# Altium schematic sheet Bench.SchDoc
size 800 x 800 mm; SheetNumber: 1; SheetTotal: 1
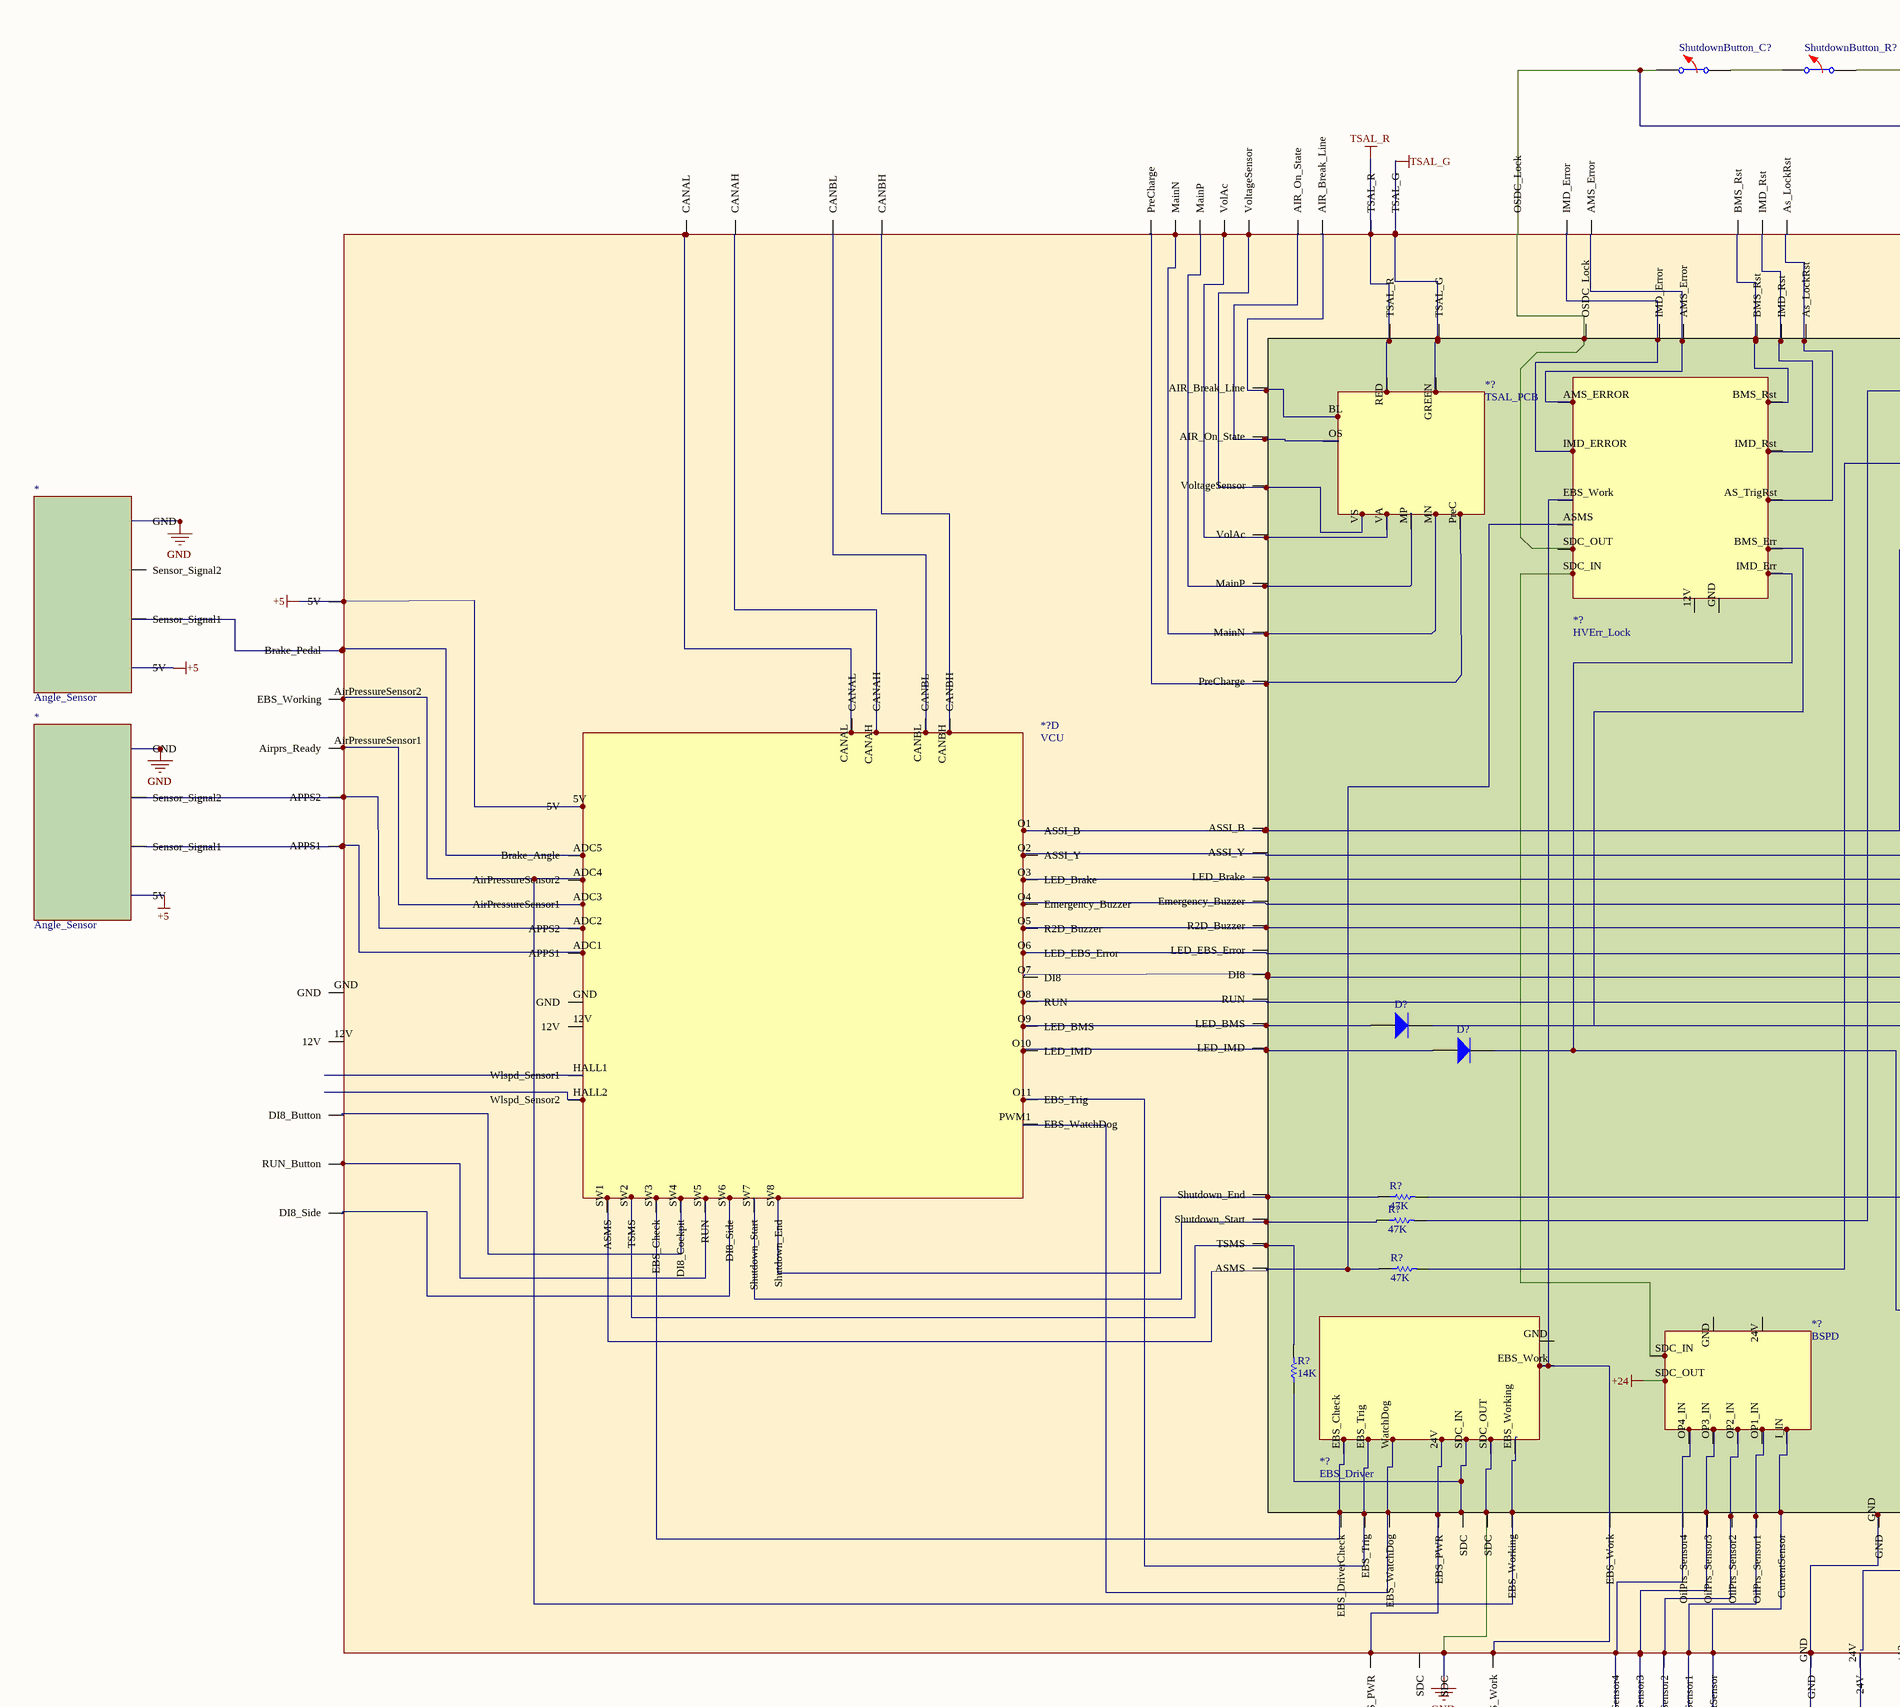
[diagram p0: Bench.SchDoc, top left]
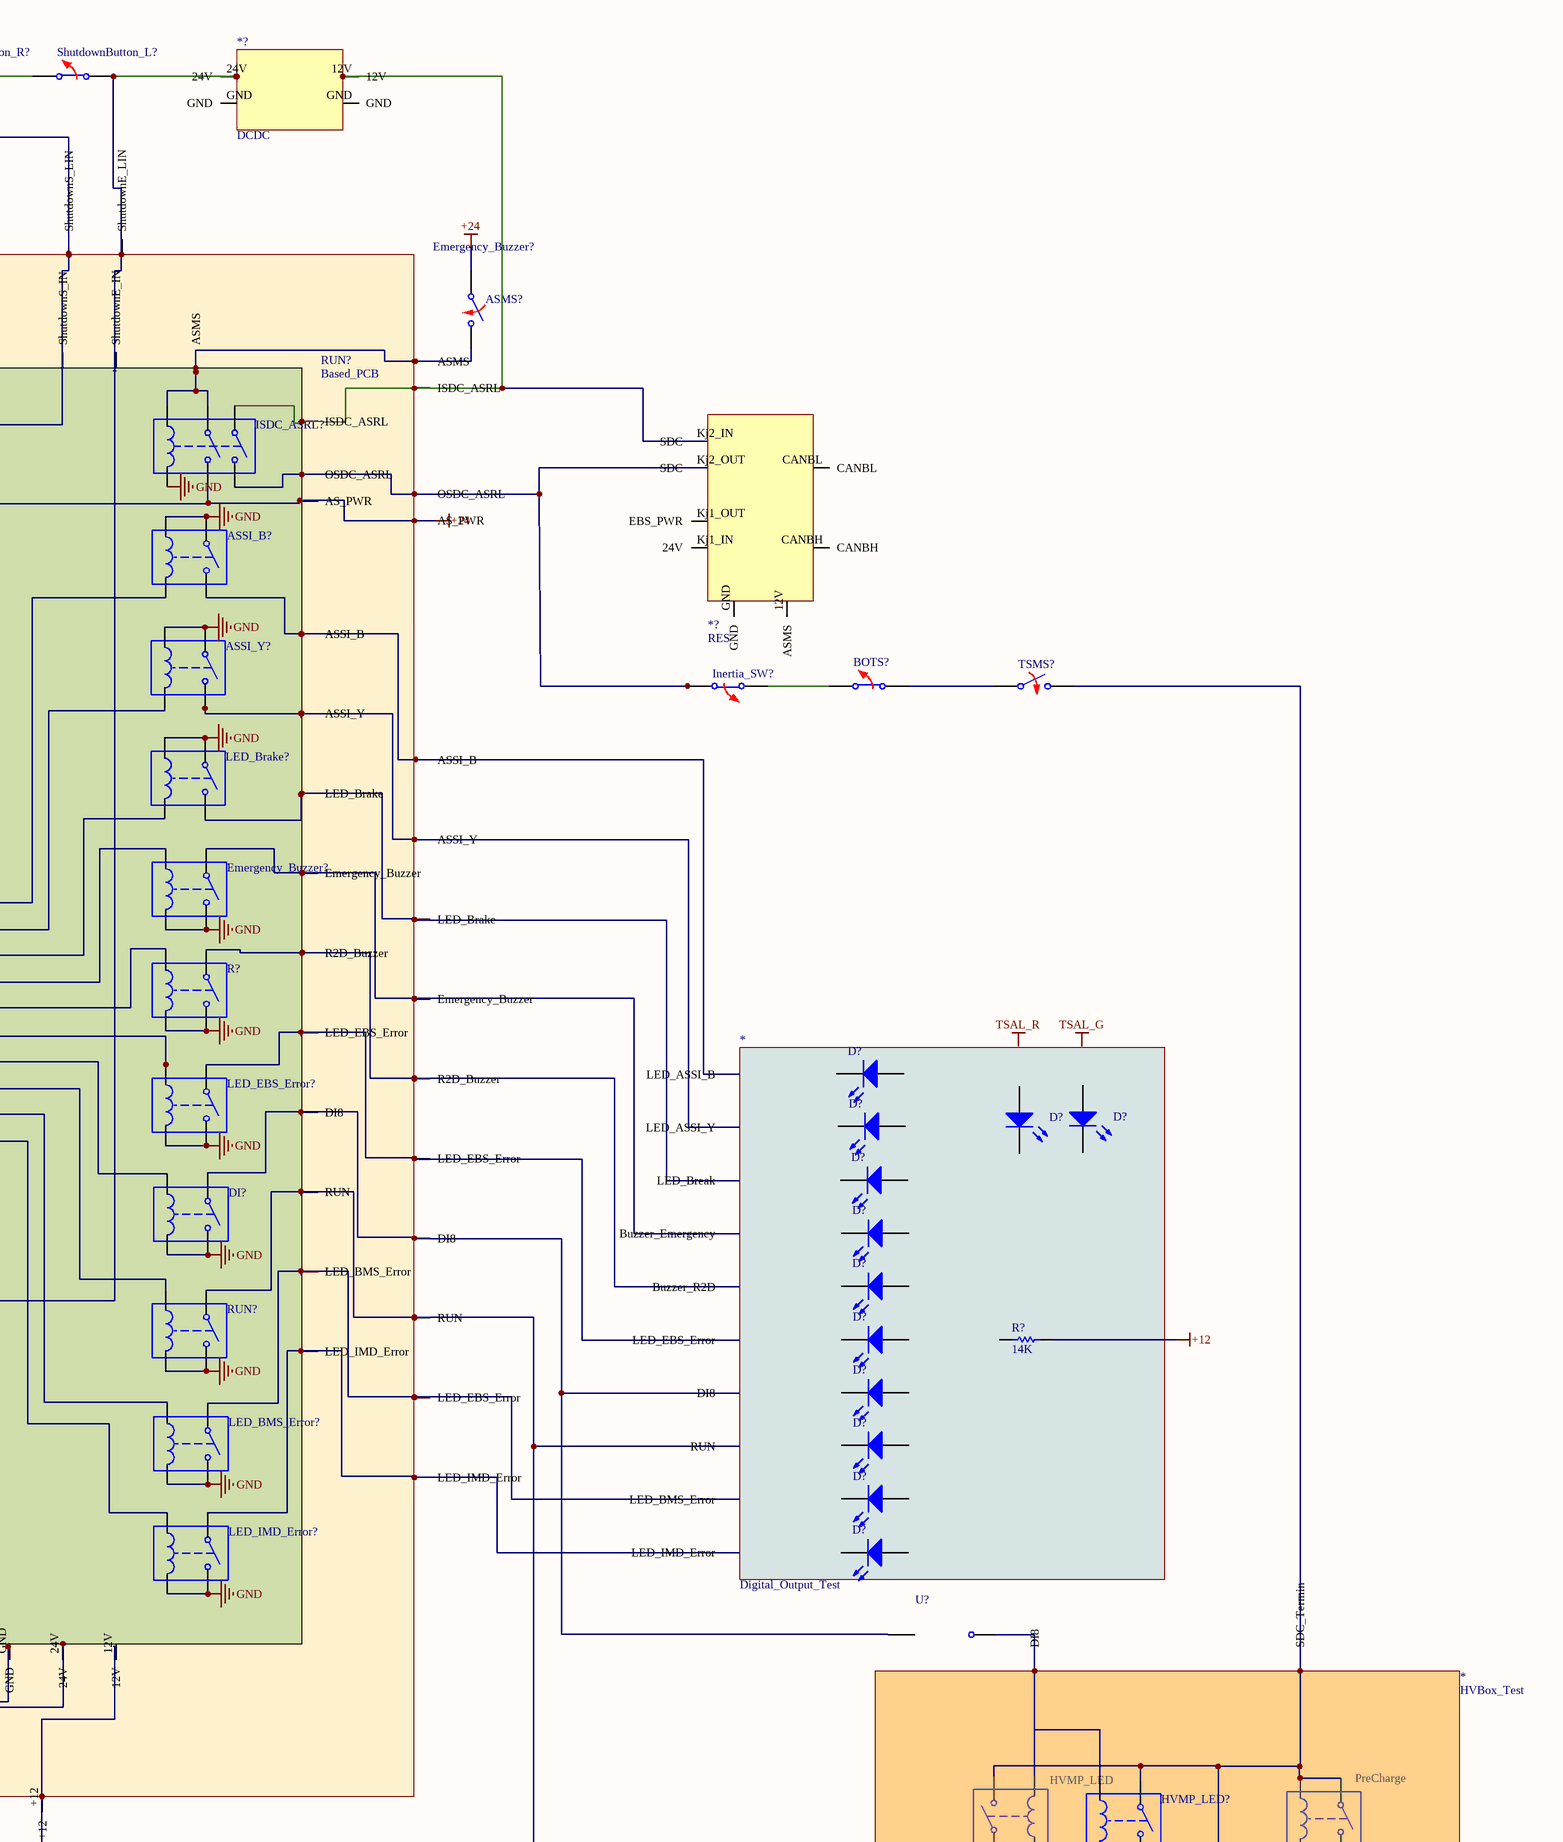
[diagram p1: Bench.SchDoc, top right]
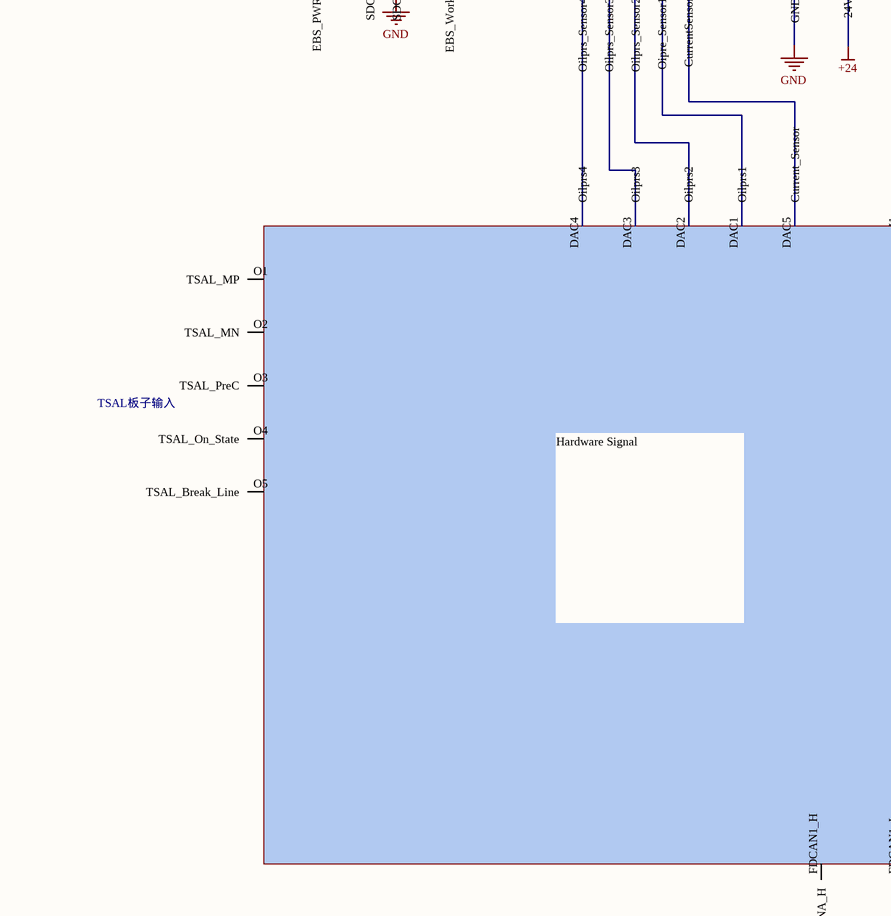
[diagram p2: Bench.SchDoc, bottom left]
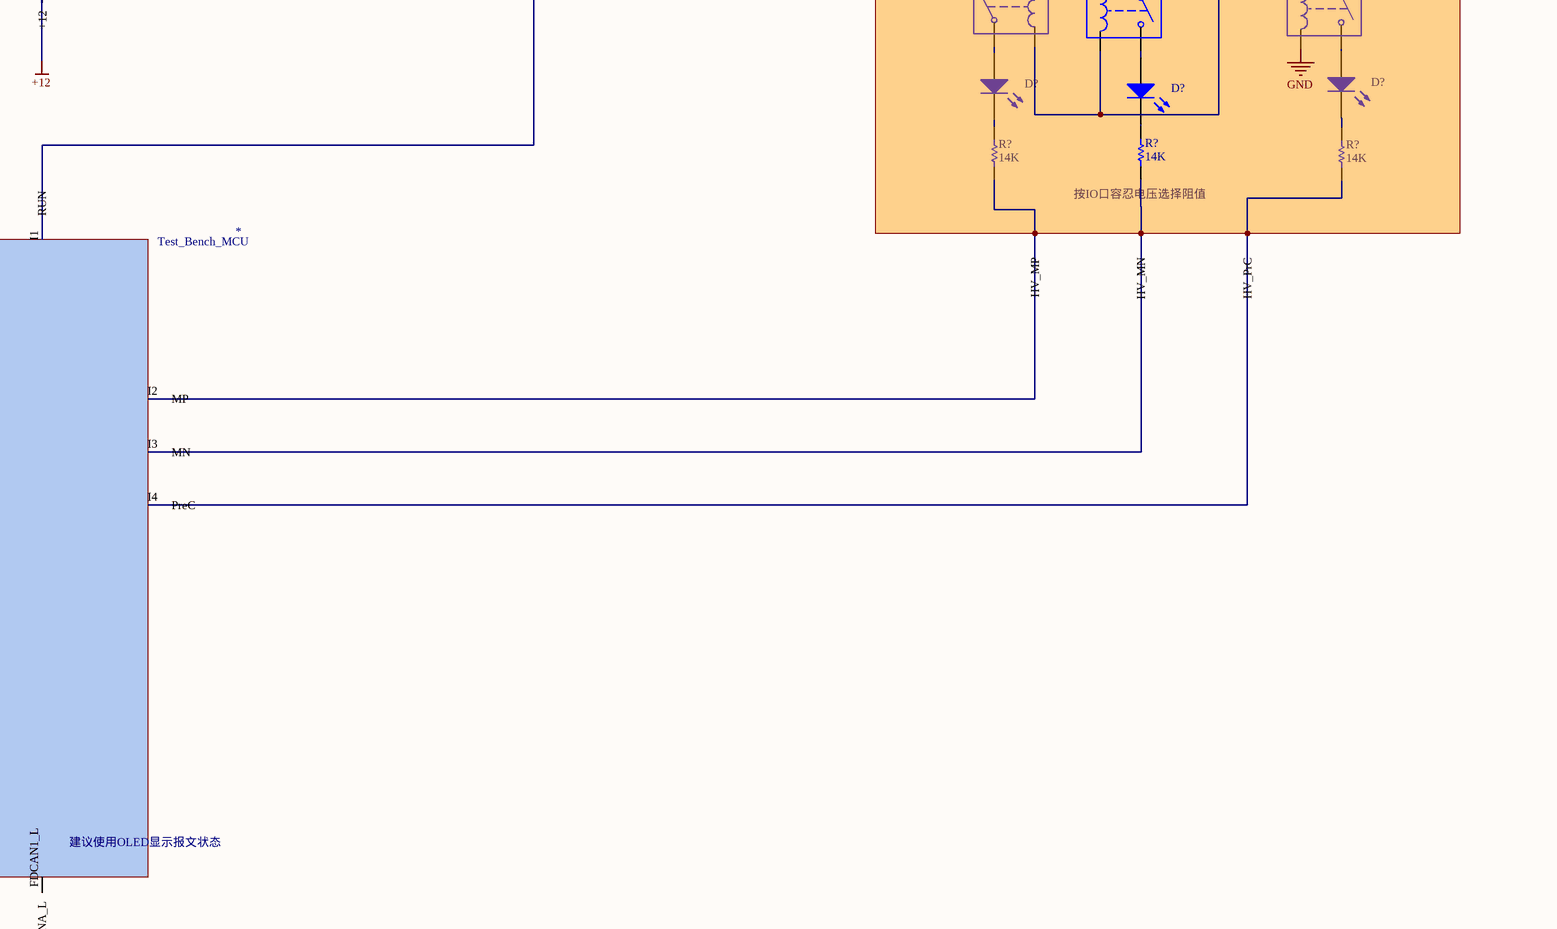
[diagram p3: Bench.SchDoc, bottom right]

## Parts
(Parts that share a designator on the sheet are numbered #1, #2 ... from top to bottom, then left to right.)
*#1  Angle_Sensor
*#2  Angle_Sensor
*#3  Digital_Output_Test
*#4  HVBox_Test
*#5  Test_Bench_MCU
*?#1  DCDC
*?#2  RES
*?#3  TSAL_PCB
*?#4  HVErr_Lock
*?#5  VCU  (part D of 4)
*?#6  BSPD
*?#7  EBS_Driver
ASMS?  Switch Normally Opened  (value not drawn)
ASSI_B?  Single-Pole, Single-Throw Normally Opened Relay  (value not drawn)
ASSI_Y?  Single-Pole, Single-Throw Normally Opened Relay  (value not drawn)
BOTS?  Switch Normally Closed  (value not drawn)
D?#1  Light-Emitting Diode  (value not drawn)
D?#2  Light-Emitting Diode  (value not drawn)
D?#3  Light-Emitting Diode  (value not drawn)
D?#4  Diode  (value not drawn)
D?#5  Light-Emitting Diode  (value not drawn)
D?#6  Diode  (value not drawn)
D?#7  Light-Emitting Diode  (value not drawn)
D?#8  Light-Emitting Diode  (value not drawn)
D?#9  Light-Emitting Diode  (value not drawn)
D?#10  Light-Emitting Diode  (value not drawn)
D?#11  Light-Emitting Diode  (value not drawn)
D?#12  Light-Emitting Diode  (value not drawn)
D?#13  Light-Emitting Diode  (value not drawn)
D?#14  Light-Emitting Diode  (value not drawn)
D?#15  Light-Emitting Diode  (value not drawn)
D?#16  Light-Emitting Diode  (value not drawn)
D?#17  Light-Emitting Diode  (value not drawn)
DI?  Single-Pole, Single-Throw Normally Opened Relay  (value not drawn)
Emergency_Buzzer?#1  Single-Pole, Single-Throw Normally Opened Relay  (value not drawn)
Emergency_Buzzer?#2  (no value)
HVMP_LED  Single-Pole, Single-Throw Normally Opened Relay  (value not drawn)
HVMP_LED?  Single-Pole, Single-Throw Normally Opened Relay  (value not drawn)
Inertia_SW?  Switch Normally Closed  (value not drawn)
ISDC_ASRL?  Double-Pole, Single-Throw Relay  (value not drawn)
LED_BMS_Error?  Single-Pole, Single-Throw Normally Opened Relay  (value not drawn)
LED_Brake?  Single-Pole, Single-Throw Normally Opened Relay  (value not drawn)
LED_EBS_Error?  Single-Pole, Single-Throw Normally Opened Relay  (value not drawn)
LED_IMD_Error?  Single-Pole, Single-Throw Normally Opened Relay  (value not drawn)
PreCharge  Single-Pole, Single-Throw Normally Opened Relay  (value not drawn)
R?#1  Single-Pole, Single-Throw Normally Opened Relay  (value not drawn)
R?#2  value 47K  (hidden comment: Resistor)
R?#3  value 47K  (hidden comment: Resistor)
R?#4  value 14K  (hidden comment: Resistor)
R?#5  value 47K  (hidden comment: Resistor)
R?#6  value 14K  (hidden comment: Resistor)
R?#7  value 14K  (hidden comment: Resistor)
R?#8  value 14K  (hidden comment: Resistor)
R?#9  value 14K  (hidden comment: Resistor)
RUN?#1  Single-Pole, Single-Throw Normally Opened Relay  (value not drawn)
RUN?#2  Based_PCB
ShutdownButton_C?  Switch Normally Closed  (value not drawn)
ShutdownButton_L?  Switch Normally Closed  (value not drawn)
ShutdownButton_R?  Switch Normally Closed  (value not drawn)
TSMS?  Switch Normally Opened  (value not drawn)
U?  Digital NOT Gate  (value not drawn)

## Nets
+5: *#1.?1(5V) *#2.?1(5V) *?#5.5V Emergency_Buzzer?#2.?43(5V)
+12: Emergency_Buzzer?#2.+12 R?#4.1
+24: *?#6.SDC_OUT ASMS?.1 Emergency_Buzzer?#2.24V Emergency_Buzzer?#2.?27(AS_PWR) ISDC_ASRL?.4 R?#5.2
GND: *#1.?4(GND) *#2.?4(GND) *?#7.SDC_OUT ASSI_B?.1 ASSI_B?.3 ASSI_Y?.1 ASSI_Y?.3 DI?.2 DI?.4 Emergency_Buzzer?#1.2 Emergency_Buzzer?#1.4 Emergency_Buzzer?#2.?37(SDC) Emergency_Buzzer?#2.GND ISDC_ASRL?.6 LED_BMS_Error?.2 LED_BMS_Error?.4 LED_Brake?.1 LED_Brake?.3 LED_EBS_Error?.2 LED_EBS_Error?.4 LED_IMD_Error?.2 LED_IMD_Error?.4 PreCharge.4 R?#1.2 R?#1.4 RUN?#1.2 RUN?#1.4 RUN?#2.?2(SDC) RUN?#2.GND
TSAL_G: *?#3.GREEN Emergency_Buzzer?#2.?18(TSAL_G) RUN?#2.?27(TSAL_G)
TSAL_R: *?#3.RED Emergency_Buzzer?#2.?17(TSAL_R)
Net*#1_?2: *#1.?2(Sensor_Signal1) *?#5.ADC5(Brake_Angle) Emergency_Buzzer?#2.?1(Brake_Pedal)
Net*#2_?2: *#2.?2(Sensor_Signal1) *?#5.ADC1(APPS1) Emergency_Buzzer?#2.?3(APPS1)
Net*#2_?3: *#2.?3(Sensor_Signal2) *?#5.ADC2(APPS2) Emergency_Buzzer?#2.?2(APPS2)
Net*#3_?1: *#3.?1(LED_ASSI_B) ASSI_B?.2 Emergency_Buzzer?#2.?28(ASSI_B) RUN?#2.?37(ASSI_B)
Net*#3_?2: *#3.?2(LED_ASSI_Y) ASSI_Y?.2 Emergency_Buzzer?#2.?29(ASSI_Y) RUN?#2.?38(ASSI_Y)
Net*#3_?3: *#3.?3(LED_Break) Emergency_Buzzer?#2.?30(LED_Brake) LED_Brake?.2 RUN?#2.?39(LED_Brake)
Net*#3_?4: *#3.?4(Buzzer_Emergency) Emergency_Buzzer?#1.1 Emergency_Buzzer?#2.?31(Emergency_Buzzer) RUN?#2.?40(Emergency_Buzzer)
Net*#3_?5: *#3.?5(Buzzer_R2D) Emergency_Buzzer?#2.?32(R2D_Buzzer) R?#1.1 RUN?#2.?41(R2D_Buzzer)
Net*#3_?6: *#3.?6(LED_EBS_Error) Emergency_Buzzer?#2.?33(LED_EBS_Error) LED_EBS_Error?.1 RUN?#2.?42(LED_EBS_Error)
Net*#3_?7: *#3.?7(DI8) DI?.1 Emergency_Buzzer?#2.?34(DI8) RUN?#2.?43(DI8) U?.1
Net*#3_?8: *#3.?8(RUN) *#5.I1(RUN) Emergency_Buzzer?#2.?35(RUN) RUN?#1.1 RUN?#2.?44(RUN)
Net*#3_?9: *#3.?9(LED_BMS_Error) Emergency_Buzzer?#2.?50(LED_EBS_Error) LED_BMS_Error?.1
Net*#3_?10: *#3.?10(LED_IMD_Error) Emergency_Buzzer?#2.?51(LED_IMD_Error) LED_IMD_Error?.1
Net*#4_?1: *#4.?1(SDC_Termin) HVMP_LED.2 HVMP_LED.3 HVMP_LED?.1 HVMP_LED?.4 PreCharge.1 PreCharge.3 TSMS?.2
Net*#4_?2: *#4.?2(DI8) HVMP_LED.4 HVMP_LED?.3 U?.2
Net*#4_?3: *#4.?3(HV_MP) *#5.I2(MP) R?#7.2
Net*#4_?4: *#4.?4(HV_MN) *#5.I3(MN) R?#8.2
Net*#4_?5: *#4.?5(HV_PrC) *#5.I4(PreC) R?#9.2
Net*#5_DAC1: *#5.DAC1(Oilprs1) *?#6.OP1_IN Emergency_Buzzer?#2.?41(Oipre_Sensor1)
Net*#5_DAC2: *#5.DAC2(Oilprs2) *?#6.OP2_IN Emergency_Buzzer?#2.?46(Oilprs_Sensor2)
Net*#5_DAC3: *#5.DAC3(Oilprs3) *?#6.OP3_IN Emergency_Buzzer?#2.?40(Oilprs_Sensor3) RUN?#2.?48(OilPrs_Sensor3)
Net*#5_DAC4: *#5.DAC4(Oilprs4) *?#6.OP4_IN Emergency_Buzzer?#2.?47(Oilprs_Sensor4)
Net*#5_DAC5: *#5.DAC5(Current_Sensor) *?#6.I_IN Emergency_Buzzer?#2.?42(CurrentSensor) RUN?#2.?8(CurrentSensor)
Net*?#1_12V: *?#1.12V *?#2.Kj2_IN(SDC) Emergency_Buzzer?#2.?25(ISDC_ASRL) ISDC_ASRL?.1 RUN?#2.?35(ISDC_ASRL)
Net*?#1_24V: *?#1.24V Emergency_Buzzer?#2.?49(ShutdownE_LIN) R?#2.2 ShutdownButton_L?.2
Net*?#2_Kj2_OUT: *?#2.Kj2_OUT(SDC) Emergency_Buzzer?#2.?26(OSDC_ASRL) Inertia_SW?.2 ISDC_ASRL?.2 RUN?#2.?36(OSDC_ASRL)
Net*?#3_BL: *?#3.BL Emergency_Buzzer?#2.?16(AIR_Break_Line)
Net*?#3_MN: *?#3.MN Emergency_Buzzer?#2.?11(MainN)
Net*?#3_MP: *?#3.MP Emergency_Buzzer?#2.?12(MainP)
Net*?#3_OS: *?#3.OS Emergency_Buzzer?#2.?15(AIR_On_State)
Net*?#3_PreC: *?#3.PreC Emergency_Buzzer?#2.?10(PreCharge)
Net*?#3_VA: *?#3.VA Emergency_Buzzer?#2.?13(VolAc)
Net*?#3_VS: *?#3.VS Emergency_Buzzer?#2.?14(VoltageSensor)
Net*?#4_AMS_ERROR: *?#4.AMS_ERROR Emergency_Buzzer?#2.?20(AMS_Error)
Net*?#4_AS_TrigRst: *?#4.AS_TrigRst Emergency_Buzzer?#2.?22(As_LockRst)
Net*?#4_ASMS: *?#4.ASMS *?#5.SW1(ASMS) R?#5.1
Net*?#4_BMS_Err: *?#4.BMS_Err D?#4.2(K) LED_BMS_Error?.3
Net*?#4_BMS_Rst: *?#4.BMS_Rst Emergency_Buzzer?#2.?23(BMS_Rst) RUN?#2.?32(BMS_Rst)
Net*?#4_EBS_Work: *?#4.EBS_Work *?#7.EBS_Work Emergency_Buzzer?#2.?39(EBS_Work)
Net*?#4_IMD_Err: *?#4.IMD_Err D?#6.2(K) LED_IMD_Error?.3
Net*?#4_IMD_ERROR: *?#4.IMD_ERROR Emergency_Buzzer?#2.?21(IMD_Error)
Net*?#4_IMD_Rst: *?#4.IMD_Rst Emergency_Buzzer?#2.?44(IMD_Rst)
Net*?#4_SDC_IN: *?#4.SDC_IN *?#6.SDC_IN
Net*?#4_SDC_OUT: *?#4.SDC_OUT Emergency_Buzzer?#2.?19(OSDC_Lock) Emergency_Buzzer?#2.?48(ShutdownS_LIN) R?#3.2 RUN?#2.?30(OSDC_Lock) ShutdownButton_C?.1
Net*?#5_ADC4: *?#5.ADC4(AirPressureSensor2) RUN?#2.?6(EBS_Working)
Net*?#5_O1: *?#5.O1(ASSI_B) ASSI_B?.4 RUN?#2.?18(ASSI_B)
Net*?#5_O2: *?#5.O2(ASSI_Y) ASSI_Y?.4
Net*?#5_O3: *?#5.O3(LED_Brake) LED_Brake?.4
Net*?#5_O4: *?#5.O4(Emergency_Buzzer) Emergency_Buzzer?#1.3
Net*?#5_O5: *?#5.O5(R2D_Buzzer) R?#1.3
Net*?#5_O6: *?#5.O6(LED_EBS_Error) LED_EBS_Error?.3
Net*?#5_O8: *?#5.O8(RUN) RUN?#1.3
Net*?#5_O9: *?#5.O9(LED_BMS) D?#4.1(A)
Net*?#5_O10: *?#5.O10(LED_IMD) D?#6.1(A) RUN?#2.?57(LED_IMD)
Net*?#5_O11: *?#5.O11(EBS_Trig) *?#7.EBS_Trig
Net*?#5_PWM1: *?#5.PWM1(EBS_WatchDog) *?#7.WatchDog RUN?#2.?5(EBS_WatchDog)
Net*?#5_SW2: *?#5.SW2(TSMS) R?#6.2
Net*?#5_SW3: *?#5.SW3(EBS_Check) *?#7.EBS_Check RUN?#2.?3(EBS_DriverCheck)
Net*?#5_SW8: *?#5.SW8(Shutdown_End) R?#2.1 RUN?#2.?53(Shutdown_End)
Net*?#7_24V: *?#7.24V Emergency_Buzzer?#2.?36(EBS_PWR)
Net*?#7_SDC_IN: *?#7.SDC_IN R?#6.1 RUN?#2.?1(SDC)
NetASMS?_2: ASMS?.2 Emergency_Buzzer?#2.?24(ASMS) ISDC_ASRL?.3 ISDC_ASRL?.5 RUN?#2.?33(ASMS)
NetBOTS?_1: BOTS?.1 Inertia_SW?.1
NetBOTS?_2: BOTS?.2 TSMS?.1
NetD?#15_1: D?#15.1(A) HVMP_LED.1
NetD?#15_2: D?#15.2(K) R?#7.1
NetD?#16_1: D?#16.1(A) HVMP_LED?.2
NetD?#16_2: D?#16.2(K) R?#8.1
NetD?#17_1: D?#17.1(A) PreCharge.2
NetD?#17_2: D?#17.2(K) R?#9.1
NetDI?_3: DI?.3 RUN?#2.?24(DI8)
NetShutdownButton_C?_2: ShutdownButton_C?.2 ShutdownButton_R?.1
NetShutdownButton_L?_1: ShutdownButton_L?.1 ShutdownButton_R?.2

Not connected (* = marked no-connect by the designer): *#1 ?3(Sensor_Signal2); *#5 FDCAN1_H(CANA_H) FDCAN1_L(CANA_L) O1(TSAL_MP) O2(TSAL_MN) O3(TSAL_PreC) O4(TSAL_On_State) O5(TSAL_Break_Line); *?#1 GND; *?#2 12V(ASMS) CANBH CANBL GND Kj1_IN(24V) Kj1_OUT(EBS_PWR); *?#4 12V GND; *?#5 12V ADC3(AirPressureSensor1) CANAH CANAL CANBH CANBL GND HALL1(Wlspd_Sensor1) HALL2(Wlspd_Sensor2) O7(DI8) SW4(DI8_Cockpit) SW5(RUN) SW6(DI8_Side) SW7(Shutdown_Start); *?#6 24V GND; *?#7 EBS_Working GND; D?#1 1(A) 2(K); D?#2 1(A) 2(K); D?#3 1(A) 2(K); D?#5 1(A) 2(K); D?#7 1(A) 2(K); D?#8 1(A) 2(K); D?#9 1(A) 2(K); D?#10 1(A) 2(K); D?#11 1(A) 2(K); D?#12 1(A) 2(K); D?#13 1(A) 2(K); D?#14 1(A) 2(K); Emergency_Buzzer?#2 12V ?4(DI8_Button) ?5(RUN_Button) ?6(CANAL) ?7(CANAH) ?8(CANBL) ?9(CANBH) ?38(SDC) ?45(DI8_Side) AirPressureSensor1(Airprs_Ready) AirPressureSensor2(EBS_Working); R?#3 1; R?#4 2; RUN?#2 12V 24V ?4(EBS_Trig) ?7(EBS_Work) ?9(OilPrs_Sensor1) ?10(OilPrs_Sensor2) ?11(AIR_Break_Line) ?12(AIR_On_State) ?13(VoltageSensor) ?14(VolAc) ?15(MainP) ?16(MainN) ?17(PreCharge) ?19(ASSI_Y) ?20(LED_Brake) ?21(Emergency_Buzzer) ?22(R2D_Buzzer) ?23(LED_EBS_Error) ?25(RUN) ?26(TSAL_R) ?28(IMD_Error) ?29(AMS_Error) ?31(IMD_Rst) ?34(AS_PWR) ?45(EBS_PWR) ?46(ASMS) ?47(TSMS) ?49(OilPrs_Sensor4) ?50(ShutdownS_IN) ?51(ShutdownE_IN) ?52(Shutdown_Start) ?54(LED_BMS_Error) ?55(LED_IMD_Error) ?56(LED_BMS) ?58(As_LockRst)

## Notes on the sheet
- (near *#4) 按IO口容忍电压选择阻值
- TSAL板子输入
- (near *#5) Hardware Signal
- Labels drawn without touching a wire or pin: TSAL_G, TSAL_R
- (in symbol Test_Bench_MCU) 建议使用OLED显示报文状态

## Library data of the parts
ASMS? TSMS? = SW NO: closed: 0; Rclosed: 1m; Ropen: 1Meg; SimulationGenericComponent: True
ASSI_B? ASSI_Y? DI? Emergency_Buzzer?#1 HVMP_LED HVMP_LED? LED_BMS_Error? LED_Brake? LED_EBS_Error? LED_IMD_Error? PreCharge R?#1 RUN?#1 = SPST Relay NO: L_C: 1u; R_C: 100; RON: 1; ROFF: 1e12; ION: 1m; IOFF: 0; SimulationGenericComponent: True
BOTS? Inertia_SW? ShutdownButton_C? ShutdownButton_L? ShutdownButton_R? = SW NC: closed: 1; Rclosed: 1m; Ropen: 1Meg; SimulationGenericComponent: True
D?#1-D?#3 D?#5 D?#7-D?#17 = LED: AF: 1; BV: 0; BV_MAX: 1e99; EG: 1.11; FC: 0.5; IBV: 0.001; IS: 1e-14; MJSW: 0.33; NTUN: 30; TNOM: 27; XTI: 3; SimulationGenericComponent: True; CJO: 0; CJP: 0; CTA: 0; CTP: 0; FCS: 0.5; FV_MAX: 1e99; IKF: 0; IKR: 0; ISR: 1e-14; JSW: 0; JTUN: 0; JTUNSW: 0; KEG: 1; KF: 0; LEVEL: 1; N: 1; NBV: 1; NR: 1; NS: 1; PHP: 1; RS: 0; TCV: 0; TLEV: 0; TLEVC: 0; TM1: 0; TM2: 0; TPB: 0; TPHP: 0; TRS: 0; TRS2: 0; TT: 0; TTT1: 0; TTT2: 0; VJ: 1; XTITUN: 3
D?#4 D?#6 = Diode: AF: 1; BV: 0; BV_MAX: 1e99; EG: 1.11; FC: 0.5; IBV: 0.001; ISR: 1e-14; MJSW: 0.33; NTUN: 30; TNOM: 27; XTI: 3; SimulationGenericComponent: True; CJO: 0; CJP: 0; CTA: 0; CTP: 0; FCS: 0.5; FV_MAX: 1e99; IKF: 0; IKR: 0; JSW: 0; JTUN: 0; JTUNSW: 0; KEG: 1; KF: 0; LEVEL: 1; N: 1; NBV: 1; NR: 1; NS: 1; PHP: 1; RS: 0; TCV: 0; TLEV: 0; TLEVC: 0; TM1: 0; TM2: 0; TPB: 0; TPHP: 0; TRS: 0; TRS2: 0; TT: 0; TTT1: 0; TTT2: 0; VJ: 1; XTITUN: 3; IS: 1e-14
Emergency_Buzzer?#2 = Low_Vol_Box_New
ISDC_ASRL? = DPST Relay: L_C: 1u; R_C: 100; RON: 1; ROFF: 1e12; ION: 1m; IOFF: 0; SimulationGenericComponent: True
R?#2-R?#9 = Resistor: TC1: 0; SimulationGenericComponent: True; TC2: 0
U? = Digital NOT: rise_delay_inst: 1n; input_load_inst: 1p; SimulationGenericComponent: True; fall_delay_inst: 1n